# Altium schematic sheet motherboard.SchDoc
size A3
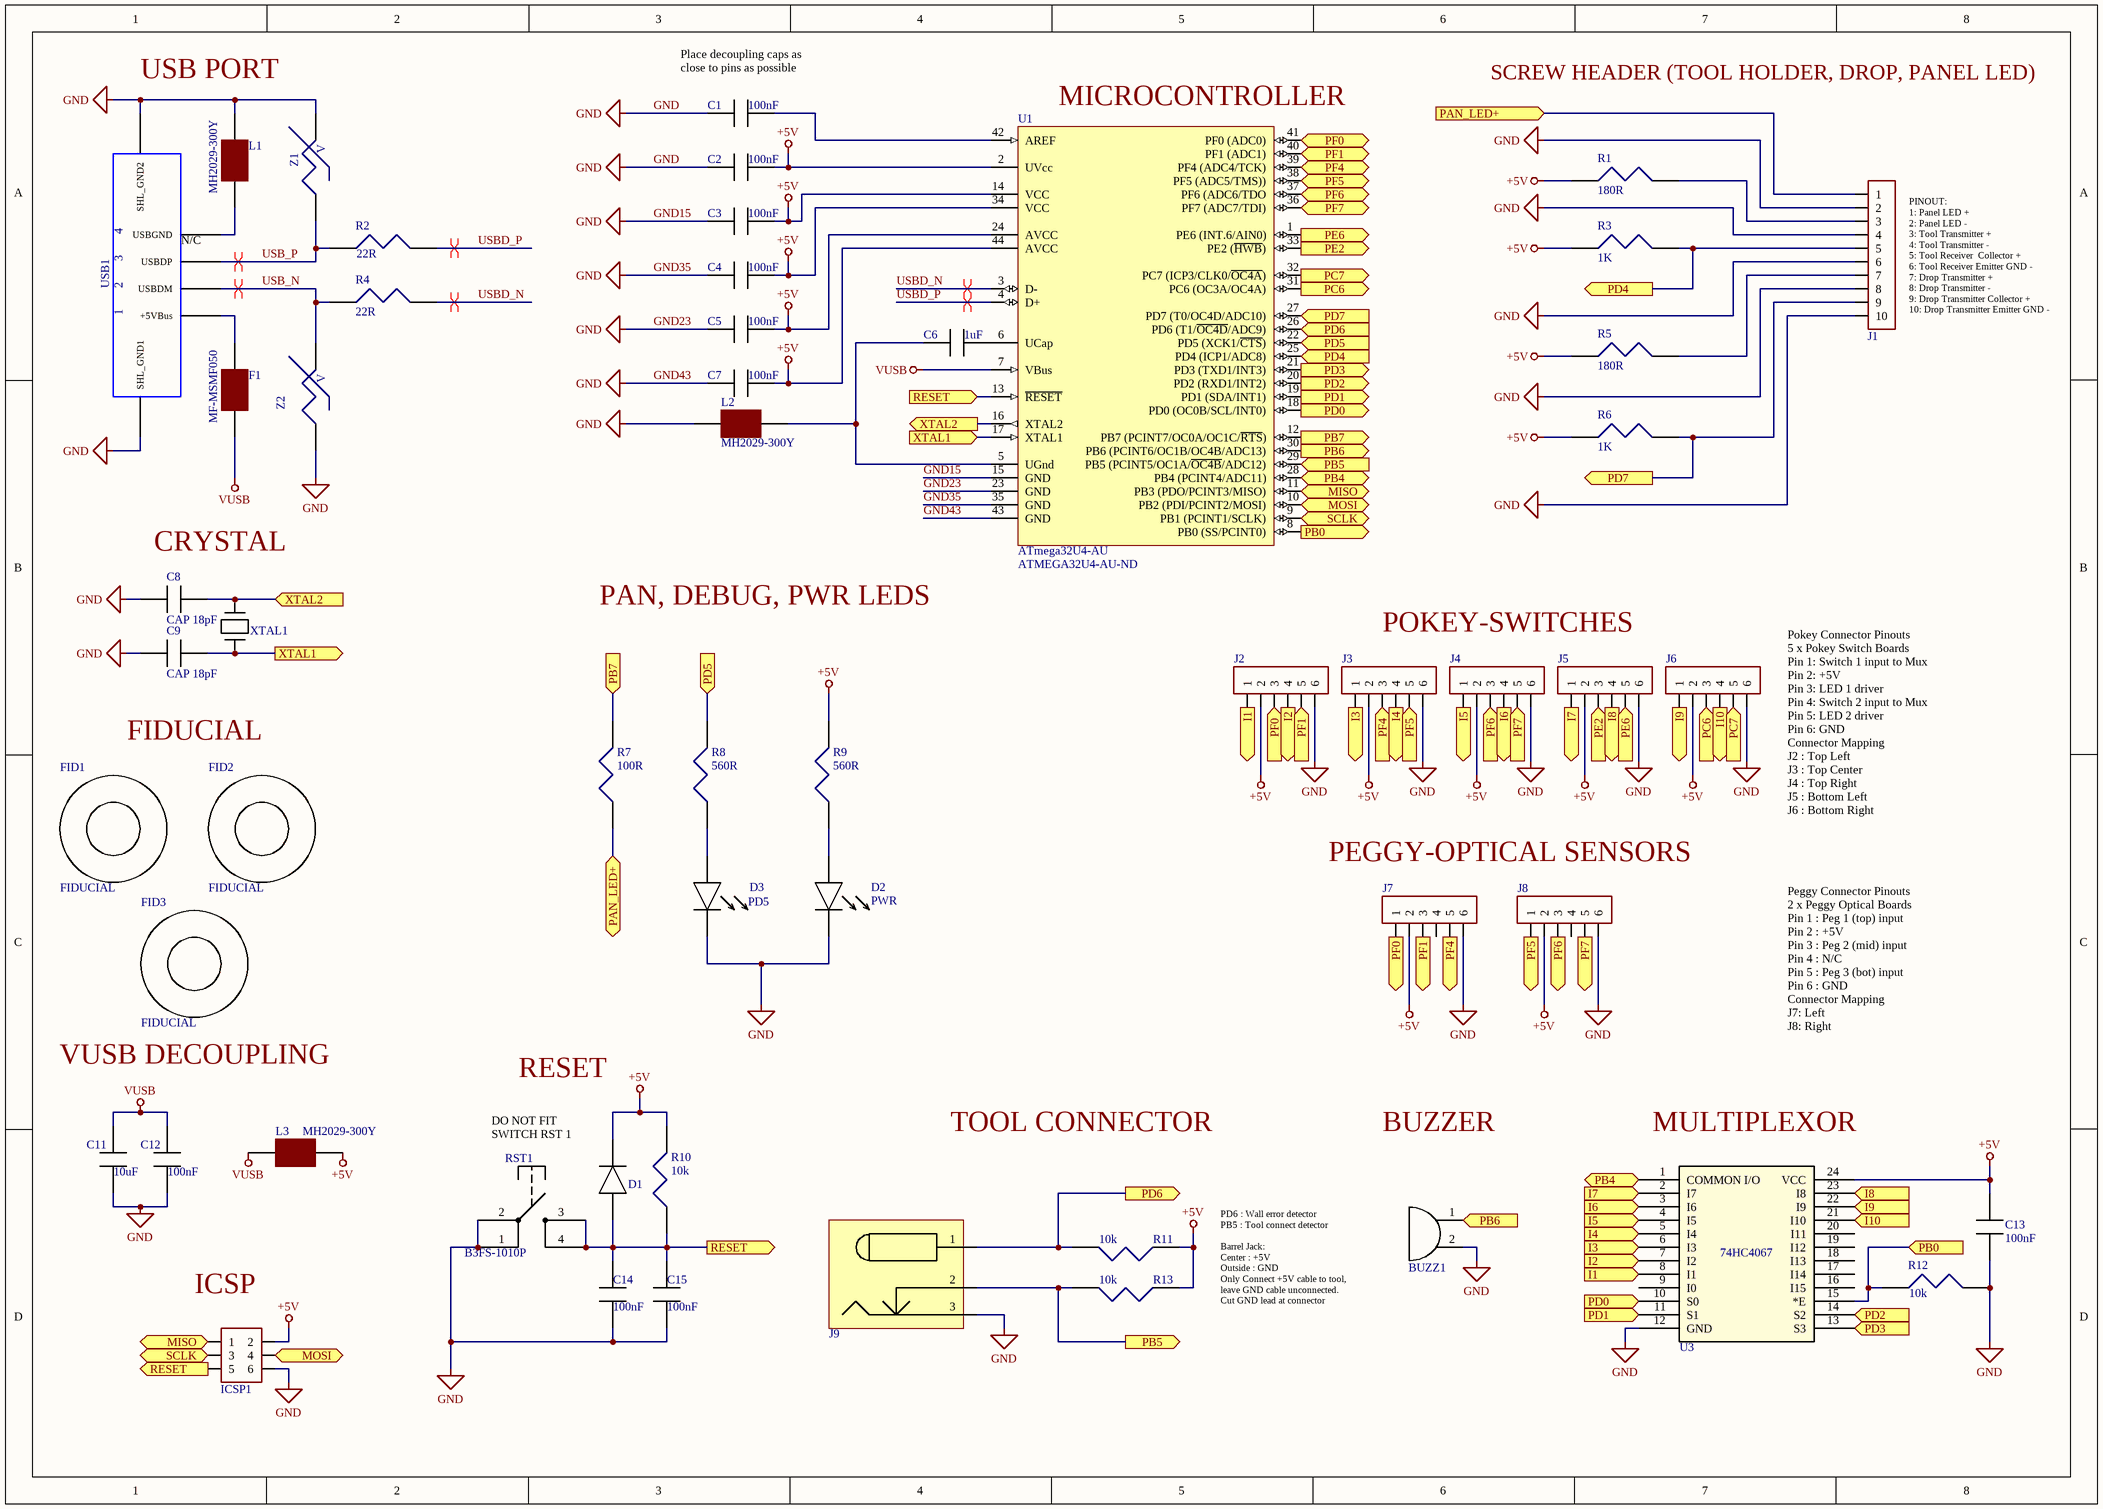
[diagram p0: motherboard.SchDoc]

## Parts
BUZZ1  CMT-1203-SMT-TR  [BUZZER]  (value not drawn)
C1  100nF  [CAPC2012X09N]
C2  100nF  [CAPC2012X09N]
C3  100nF  [CAPC2012X09N]
C4  100nF  [CAPC2012X09N]
C5  100nF  [CAPC2012X09N]
C6  1uF  [CAPC2012X14N]
C7  100nF  [CAPC2012X09N]
C8  CAP 18pF  [CAPC2012X08N]
C9  CAP 18pF  [CAPC2012X08N]
C11  10uF  [CAPC2012X14N]
C12  100nF  [CAPC2012X09N]
C13  100nF  [CAPC2012X09N]
C14  100nF  [CAPC2012X09N]
C15  100nF  [CAPC2012X09N]
D1  Diode 100V 150mA  [DIOC3215X09N]  (value not drawn)
D2  PWR  [0603LED]
D3  PD5  [0603LED]
F1  MF-MSMF050  [FUSE MF-MSMF050]
FID1  FIDUCIAL  [FID]  (no BOM)
FID2  FIDUCIAL  [FID]  (no BOM)
FID3  FIDUCIAL  [FID]  (no BOM)
ICSP1  67997-206HLF  [3x2 Pin Header]  (value not drawn)
J1  CONN 10 POS  [CONN 10 POS]  (value not drawn)
J2  POK-TL  [FFC CONNECTOR]  (value not drawn)
J3  POK-TM  [FFC CONNECTOR]  (value not drawn)
J4  POK-TR  [FFC CONNECTOR]  (value not drawn)
J5  POK-BL  [FFC CONNECTOR]  (value not drawn)
J6  POK-BR  [FFC CONNECTOR]  (value not drawn)
J7  PEG-L  [FFC CONNECTOR]  (value not drawn)
J8  PEG-R  [FFC CONNECTOR]  (value not drawn)
J9  Barrel Connector  [Barrel Power Connector]  (value not drawn)
L1  MH2029-300Y  [INDC2012X11N]
L2  MH2029-300Y  [INDC2012X11N]
L3  MH2029-300Y  [INDC2012X11N]
R1  180R  [RESC2012X07N_SAMSUNG]
R2  22R  [RESC2012X07N]
R3  1K  [RESC2012X07N_SAMSUNG]
R4  22R  [RESC2012X07N]
R5  180R  [RESC2012X07N_SAMSUNG]
R6  1K  [RESC2012X07N_SAMSUNG]
R7  100R  [RESC2012X07N_SAMSUNG]
R8  560R  [RESC2012X07N_SAMSUNG]
R9  560R  [RESC2012X07N_SAMSUNG]
R10  10k  [RESC2012X07N_SAMSUNG]
R11  10k  [RESC2012X07N_SAMSUNG]
R12  10k  [RESC2012X07N_SAMSUNG]
R13  10k  [RESC2012X07N_SAMSUNG]
RST1  B3FS-1010P  [SWITCH]
U1  ATmega32U4-AU  Supplier Part Number 1: ATMEGA32U4-AU-ND  [44ML_N]
U3  74HC4067 SOIC  [SOIC127P1030X265-24N]  (value not drawn)
USB1  USB  [USB B RECEPTACLE]  (value not drawn)
XTAL1  9C-16.000MEEJ-T  [XTAL]  (value not drawn)
Z1  CG0603MLC  [RESC1608X06N]  (value not drawn)
Z2  CG0603MLC  [RESC1608X06N]  (value not drawn)

## Ports
I1, I2, I3, I4, I5, I6, I7, I8, I9, I10, MISO, MOSI, PAN_LED+, PB0, PB4, PB5, PB6, PB7, PC6, PC7, PD0, PD1, PD2, PD3, PD4, PD5, PD6, PD7, PE2, PE6, PF0, PF1, PF4, PF5, PF6, PF7, RESET, SCLK, XTAL1, XTAL2

## Nets
+5V: C2.2 C3.1 C4.1 C5.1 C7.1 C13.2 D1.2 ICSP1.2 J2.2 J3.2 J4.2 J5.2 J6.2 J7.2 J8.2 L3.2 R1.1 R3.1 R5.1 R6.1 R9.2 R10.2 R11.1 R13.1 U1.2(UVcc) U1.14(VCC) U1.24(AVCC) U1.34(VCC) U1.44(AVCC) U3.24(VCC)
GND: BUZZ1.2 C1.1 C2.1 C3.2 C4.2 C5.2 C7.2 C8.1 C9.1 C11.1 C12.1 C13.1 C14.1 C15.1 D2.2 D3.2 ICSP1.6 J1.2 J1.4 J1.6 J1.8 J1.10 J2.6 J3.6 J4.6 J5.6 J6.6 J7.6 J8.6 J9.3 L1.2 L2.1 R12.2 RST1.1 RST1.2 U1.15(GND) U1.23(GND) U1.35(GND) U1.43(GND) U3.12(GND) USB1.SHL_GND1 USB1.SHL_GND2 Z1.2 Z2.1  [also labelled GND15, GND23, GND35, GND43]
VUSB: C11.2 C12.2 F1.1 L3.1 U1.7(VBus)
I1: J2.1 U3.8(I1) ; port I1
I2: J2.4 U3.7(I2) ; port I2
I3: J3.1 U3.6(I3) ; port I3
I4: J3.4 U3.5(I4) ; port I4
I5: J4.1 U3.4(I5) ; port I5
I6: J4.4 U3.3(I6) ; port I6
I7: J5.1 U3.2(I7) ; port I7
I8: J5.4 U3.23(I8) ; port I8
I9: J6.1 U3.22(I9) ; port I9
I10: J6.4 U3.21(I10) ; port I10
MISO: ICSP1.1 U1.11(PB3_(PDO/PCINT3/MISO)) ; port MISO
MOSI: ICSP1.4 U1.10(PB2_(PDI/PCINT2/MOSI)) ; port MOSI
PAN_LED+: J1.1 R7.1 ; port PAN_LED+
PB0: R12.1 U1.8(PB0_(SS/PCINT0)) U3.15(*E) ; port PB0
PB4: U1.28(PB4_(PCINT4/ADC11)) U3.1(COMMON_I/O) ; port PB4
PB5: J9.2 R13.2 U1.29(PB5_(PCINT5/OC1A/~{OC4B}/ADC12)) ; port PB5
PB6: BUZZ1.1 U1.30(PB6_(PCINT6/OC1B/OC4B/ADC13)) ; port PB6
PB7: R7.2 U1.12(PB7_(PCINT7/OC0A/OC1C/~{RTS})) ; port PB7
PC6: J6.3 U1.31(PC6_(OC3A/OC4A)) ; port PC6
PC7: J6.5 U1.32(PC7_(ICP3/CLK0/~{OC4A})) ; port PC7
PD0: U1.18(PD0_(OC0B/SCL/INT0)) U3.10(S0) ; port PD0
PD1: U1.19(PD1_(SDA/INT1)) U3.11(S1) ; port PD1
PD2: U1.20(PD2_(RXD1/INT2)) U3.14(S2) ; port PD2
PD3: U1.21(PD3_(TXD1/INT3)) U3.13(S3) ; port PD3
PD4: J1.5 R3.2 U1.25(PD4_(ICP1/ADC8)) ; port PD4
PD5: R8.2 U1.22(PD5_(XCK1/~{CTS})) ; port PD5
PD6: J9.1 R11.2 U1.26(PD6_(T1/~{OC4D}/ADC9)) ; port PD6
PD7: J1.9 R6.2 U1.27(PD7_(T0/OC4D/ADC10)) ; port PD7
PE2: J5.3 U1.33(PE2_(~{HWB})) ; port PE2
PE6: J5.5 U1.1(PE6_(INT.6/AIN0)) ; port PE6
PF0: J2.3 J7.1 U1.41(PF0_(ADC0)) ; port PF0
PF1: J2.5 J7.3 U1.40(PF1_(ADC1)) ; port PF1
PF4: J3.3 J7.5 U1.39(PF4_(ADC4/TCK)) ; port PF4
PF5: J3.5 J8.1 U1.38(PF5_(ADC5/TMS))) ; port PF5
PF6: J4.3 J8.3 U1.37(PF6_(ADC6/TDO) ; port PF6
PF7: J4.5 J8.5 U1.36(PF7_(ADC7/TDI)) ; port PF7
RESET: C14.2 C15.2 D1.1 ICSP1.5 R10.1 RST1.3 RST1.4 U1.13(~{RESET}) ; port RESET
SCLK: ICSP1.3 U1.9(PB1_(PCINT1/SCLK)) ; port SCLK
USB_N: R4.1 USB1.USBDM Z2.2
USB_P: R2.1 USB1.USBDP Z1.1
USBD_N: R4.2 U1.3(D-)
USBD_P: R2.2 U1.4(D+)
XTAL1: C9.2 U1.17(XTAL1) XTAL1.1 ; port XTAL1
XTAL2: C8.2 U1.16(XTAL2) XTAL1.2 ; port XTAL2
NetC1_2: C1.2 U1.42(AREF)
NetC6_1: C6.1 L2.2 U1.5(UGnd)
NetC6_2: C6.2 U1.6(UCap)
NetD2_1: D2.1 R9.1
NetD3_1: D3.1 R8.1
NetF1_2: F1.2 USB1.+5VBus
NetJ1_3: J1.3 R1.2
NetJ1_7: J1.7 R5.2
NetL1_1: L1.1 USB1.USBGND

Not connected (* = marked no-connect by the designer): J7 4; J8 4; U3 9(I0) 16(I15) 17(I14) 18(I13) 19(I12) 20(I11)

## Layout directives
differential pair: USB_N, USB_P, USBD_N, USBD_P

## Notes on the sheet
- USB PORT
- (near C1) Place decoupling caps as close to pins as possible
- (near U1) MICROCONTROLLER
- SCREW HEADER (TOOL HOLDER, DROP, PANEL LED)
- (near USB1) N/C
- (near J1) PINOUT:
  1: Panel LED +
  2: Panel LED -
  3: Tool Transmitter +
  4: Tool Transmitter -
  5: Tool Receiver  Collector +
  6: Tool Receiver Emitter GND -
  7: Drop Transmitter +
  8: Drop Transmitter -
  9: Drop Transmitter Collector +
  10: Drop Transmitter Emitter GND -
- CRYSTAL
- PAN, DEBUG, PWR LEDS
- POKEY-SWITCHES
- FIDUCIAL
- (near J6) Pokey Connector Pinouts
  5 x Pokey Switch Boards
  Pin 1: Switch 1 input to Mux
  Pin 2: +5V
  Pin 3: LED 1 driver
  Pin 4: Switch 2 input to Mux
  Pin 5: LED 2 driver
  Pin 6: GND
  Connector Mapping
  J2 : Top Left
  J3 : Top Center
  J4 : Top Right
  J5 : Bottom Left
  J6 : Bottom Right
- PEGGY-OPTICAL SENSORS
- Peggy Connector Pinouts
  2 x Peggy Optical Boards
  Pin 1 : Peg 1 (top) input
  Pin 2 : +5V
  Pin 3 : Peg 2 (mid) input
  Pin 4 : N/C
  Pin 5 : Peg 3 (bot) input
  Pin 6 : GND
  Connector Mapping
  J7: Left
  J8: Right
- VUSB DECOUPLING
- RESET
- (near D1) DO NOT FIT SWITCH RST 1
- TOOL CONNECTOR
- BUZZER
- (near U3) MULTIPLEXOR
- (near ICSP1) ICSP
- PD6 : Wall error detector
  PB5 : Tool connect detector
  Barrel Jack:
  Center : +5V
  Outside : GND
  Only Connect +5V cable to tool, leave GND cable unconnected.
  Cut GND lead at connector
- (in symbol 61729-1011BLF) 3; 2; 1
- (in symbol CD74HC4067M96) 74HC4067
- (in symbol CG0603MLC-05E) V

## Library data of the parts
BUZZ1 = CMT-1203-SMT-TR: BUZZER PIEZO 5V 12MM SMD; Manufacturer: CUI Inc.; Driver Circuitry: Transducer, Externally Driven; Input Type: Peak-Peak Signal; Voltage Range: 25V (Max); Frequency: 4kHz; Operating Mode: Single Tone; Sound Pressure Level: 81dB @ 5V, 10cm; Current - Supply: 5mA; Port Location: Side; Supplier 1: Digi-Key; Manufacturer Part Number: CMT-1203-SMT-TR; RoHS: RoHS Compliant; Category: Audio Products; Stock 1: 18150; Pricing 1: 1=2.76, 10=2.29, 100=1.6962, 500=1.35696 (USD); Packaging: Cut Tape (CT); Technology: Piezo; Voltage - Rated: 5V; Duration: -; Operating Temperature: -40°C ~ 120°C; Approvals: -; Ratings: -; Mounting Type: Surface Mount; Termination: Solder Pads; Size / Dimension: 12.0mm L x 12.0mm W x 3.3mm H; Height - Seated (Max): *; ComponentLink1URL: http://www.cui.com/product/resource/digikeypdf/cmt-1203-smt.pdf; ComponentLink1Description: http://www.cui.com/product/resource/digikeypdf/cmt-1203-smt.pdf; Supplier Part Number 1: 102-2197-1-ND
C1-C5 C7 C12-C15 = CL21F104ZBCNNNC: CAP CER 0.1UF 50V Y5V 0805; Manufacturer: Samsung Electro-Mechanics America, Inc.; Capacitance: 0.10µF; Tolerance: -20%, +80%; Temperature Coefficient: Y5V (F); Supplier 1: Digi-Key; Manufacturer Part Number: CL21F104ZBCNNNC; RoHS: RoHS Compliant; Category: Capacitors; Stock 1: 1030146; Pricing 1: 1=0.1, 10=0.031, 25=0.022, 50=0.017, 100=0.0144, 500=0.01004, 1000=0.00783 (USD); Packaging: Cut Tape (CT); Voltage - Rated: 50V; Mounting Type: Surface Mount, MLCC; Operating Temperature: -30°C ~ 85°C; Applications: General Purpose; Ratings: -; Package / Case: 0805 (2012 Metric); Size / Dimension: 0.079" L x 0.049" W (2.00mm x 1.25mm); Height - Seated (Max): -; Thickness (Max): 0.037" (0.95mm); Lead Spacing: -; Features: -; Lead Style: -; ComponentLink1URL: http://www.samsungsem.com/kr/support/product-search/mlcc/CL21F104ZBCNNNC.jsp; ComponentLink1Description: http://www.samsungsem.com/kr/support/product-search/mlcc/CL21F104ZBCNNNC.jsp; Supplier Part Number 1: 1276-1007-1-ND
C6 = CL21A105KBCLNNC: CAP CER 1UF 50V X5R 0805; Manufacturer: Samsung Electro-Mechanics America, Inc.; Capacitance: 1µF; Tolerance: ±10%; Supplier 1: Digi-Key; Manufacturer Part Number: CL21A105KBCLNNC; RoHS: RoHS Compliant; Category: Capacitors; Stock 1: 6541; Pricing 1: 1=0.26, 10=0.216, 25=0.1484, 50=0.1216, 100=0.108, 500=0.07156, 1000=0.06345 (USD); Packaging: Cut Tape (CT); Voltage - Rated: 50V; Temperature Coefficient: X5R; Mounting Type: Surface Mount, MLCC; Operating Temperature: -55°C ~ 85°C; Applications: General Purpose; Ratings: -; Package / Case: 0805 (2012 Metric); Size / Dimension: 0.079" L x 0.049" W (2.00mm x 1.25mm); Height - Seated (Max): -; Thickness (Max): 0.037" (0.95mm); Lead Spacing: -; Features: -; Lead Style: -; ComponentLink1URL: http://media.digikey.com/pdf/Data%20Sheets/Samsung%20PDFs/CL21A105KBCLNNC_Spec.pdf; ComponentLink1Description: http://media.digikey.com/pdf/Data%20Sheets/Samsung%20PDFs/CL21A105KBCLNNC_Spec.pdf; Supplier Part Number 1: 1276-2396-1-ND
C8 C9 = CL21C180JBANNNC: CAP CER 18PF 50V NP0 0805; Manufacturer: Samsung Electro-Mechanics America, Inc.; Tolerance: ±5%; Temperature Coefficient: C0G, NP0; Supplier 1: Digi-Key; Manufacturer Part Number: CL21C180JBANNNC; RoHS: RoHS Compliant; Category: Capacitors; Stock 1: 75846; Pricing 1: 1=0.1, 10=0.048, 25=0.034, 50=0.026, 100=0.022, 500=0.0154, 1000=0.012 (USD); Packaging: Cut Tape (CT); Capacitance: 18pF; Voltage - Rated: 50V; Mounting Type: Surface Mount, MLCC; Operating Temperature: -55°C ~ 125°C; Applications: General Purpose; Ratings: -; Package / Case: 0805 (2012 Metric); Size / Dimension: 0.079" L x 0.049" W (2.00mm x 1.25mm); Height - Seated (Max): -; Thickness (Max): 0.030" (0.75mm); Lead Spacing: -; Features: -; Lead Style: -; ComponentLink1URL: http://www.samsungsem.com/kr/support/product-search/mlcc/CL21C180JBANNNC.jsp; ComponentLink1Description: http://www.samsungsem.com/kr/support/product-search/mlcc/CL21C180JBANNNC.jsp; Supplier Part Number 1: 1276-1107-1-ND
C11 = CL21A106KAYNNNE: CAP CER 10UF 25V X5R 0805; Manufacturer: Samsung Electro-Mechanics America, Inc.; Capacitance: 10µF; Tolerance: ±10%; Supplier 1: Digi-Key; Manufacturer Part Number: CL21A106KAYNNNE; RoHS: RoHS Compliant; Category: Capacitors; Stock 1: 312876; Pricing 1: 1=0.24, 10=0.165, 25=0.12, 50=0.1, 100=0.084, 500=0.06, 1000=0.051 (USD); Packaging: Cut Tape (CT); Voltage - Rated: 25V; Temperature Coefficient: X5R; Mounting Type: Surface Mount, MLCC; Operating Temperature: -55°C ~ 85°C; Applications: General Purpose; Ratings: -; Package / Case: 0805 (2012 Metric); Size / Dimension: 0.079" L x 0.049" W (2.00mm x 1.25mm); Height - Seated (Max): -; Thickness (Max): 0.057" (1.45mm); Lead Spacing: -; Features: -; Lead Style: -; ComponentLink1URL: http://www.samsungsem.com/kr/support/product-search/mlcc/CL21A106KAYNNNE.jsp; ComponentLink1Description: http://www.samsungsem.com/kr/support/product-search/mlcc/CL21A106KAYNNNE.jsp; Supplier Part Number 1: 1276-2891-1-ND
D1 = CD1206-S01575: DIODE GEN PURP 100V 150MA 1206; Manufacturer: Bourns Inc.; Diode Type: Standard; Voltage - Forward (Vf) (Max) @ If: 1V @ 50mA; Speed: Small Signal =< 200mA (Io), Any Speed; Reverse Recovery Time (trr): 4ns; Current - Reverse Leakage @ Vr: 2.5µA @ 100V; Capacitance @ Vr, F: 3pF @ 0V, 100MHz; Supplier 1: Digi-Key; Manufacturer Part Number: CD1206-S01575; RoHS: RoHS Compliant; Category: Discrete Semiconductor Products; Stock 1: 15991; Pricing 1: 1=0.15, 10=0.142, 25=0.1288, 100=0.0927, 250=0.0546, 500=0.0453, 1000=0.0309, 2500=0.0263 (USD); Packaging: Cut Tape (CT); Voltage - DC Reverse (Vr) (Max): 100V; Current - Average Rectified (Io): 150mA; Mounting Type: Surface Mount; Package / Case: 1206 (3216 Metric); Supplier Device Package: 1206; Operating Temperature - Junction: -55°C ~ 125°C; ComponentLink1URL: http://www.bourns.com/docs/Product-Datasheets/CD1206_S01575.pdf; ComponentLink1Description: http://www.bourns.com/docs/Product-Datasheets/CD1206_S01575.pdf; Supplier Part Number 1: CD1206-S01575CT-ND
D2 = LG L29K-F2J1-24: LED GREEN DIFFUSED 0603 SMD; Manufacturer: OSRAM Opto Semiconductors Inc.; Lens Color: White; Millicandela Rating: 3.5mcd; Lens Style/Size: Rectangle with Flat Top, 1.30mm x 0.80mm; Voltage - Forward (Vf) (Typ): 1.7V; Current - Test: 2mA; Viewing Angle: 160°; Wavelength - Dominant: 570nm; Wavelength - Peak: 572nm; Supplier 1: Digi-Key; Manufacturer Part Number: LG L29K-F2J1-24; RoHS: RoHS Compliant; Category: Optoelectronics; Stock 1: 30762; Pricing 1: 1=0.38, 10=0.266, 25=0.2184, 100=0.1746, 250=0.13092, 500=0.11902, 1000=0.09522, 2500=0.07737 (USD); Packaging: Cut Tape (CT); Color: Green; Lens Transparency: Diffused; Mounting Type: Surface Mount; Features: -; Package / Case: 0603 (1608 Metric); Supplier Device Package: *; Size / Dimension: 1.70mm L x 0.80mm W; Height (Max): 0.65mm; ComponentLink1URL: http://www.osram-os.com/Graphics/XPic2/00077107_0.pdf; ComponentLink1Description: http://www.osram-os.com/Graphics/XPic2/00077107_0.pdf; Supplier Part Number 1: 475-1193-1-ND
D3 = LS L29K-H1J2-1-Z: LED RED DIFFUSED 0603 SMD; Manufacturer: OSRAM Opto Semiconductors Inc.; Lens Color: White; Millicandela Rating: 4.95mcd; Lens Style/Size: Rectangle with Flat Top, 1.30mm x 0.80mm; Voltage - Forward (Vf) (Typ): 1.8V; Current - Test: 2mA; Viewing Angle: 160°; Wavelength - Dominant: 630nm; Wavelength - Peak: 643nm; Supplier 1: Digi-Key; Manufacturer Part Number: LS L29K-H1J2-1-Z; RoHS: RoHS Compliant; Category: Optoelectronics; Stock 1: 77723; Pricing 1: 1=0.33, 10=0.257, 25=0.2096, 100=0.1666, 250=0.14284, 500=0.12378, 1000=0.09522, 2500=0.0857 (USD); Packaging: Cut Tape (CT); Color: Red; Lens Transparency: Diffused; Mounting Type: Surface Mount; Features: -; Package / Case: 0603 (1608 Metric); Supplier Device Package: *; Size / Dimension: 1.70mm L x 0.80mm W; Height (Max): 0.65mm; ComponentLink1URL: http://www.osram-os.com/Graphics/XPic2/00077099_0.pdf; ComponentLink1Description: http://www.osram-os.com/Graphics/XPic2/00077099_0.pdf; Supplier Part Number 1: 475-1195-1-ND
F1 = MF-MSMF050-2: PTC RESETTABLE .50A 15V 1812; Manufacturer: Bourns Inc.; Current - Max: 100A; Current - Hold (Ih) (Max): 500mA; Current - Trip (It): 1A; R Min/Max: 0.150 ~ 1.000 Ohm; Time to Trip: 0.15s; Supplier 1: Digi-Key; Manufacturer Part Number: MF-MSMF050-2; RoHS: RoHS Compliant; Category: Circuit Protection; Stock 1: 97387; Pricing 1: 1=0.22, 10=0.201, 25=0.186, 50=0.1794, 100=0.167, 250=0.14868, 500=0.1239, 1000=0.11741 (USD); Packaging: Cut Tape (CT); Voltage - Max: 15V; Package / Case: 1812 (4532 Metric), Concave; ComponentLink1URL: http://www.bourns.com/docs/Product-Datasheets/mfmsmf.pdf; ComponentLink1Description: http://www.bourns.com/docs/Product-Datasheets/mfmsmf.pdf; Supplier Part Number 1: MF-MSMF050-2CT-ND
FID1-FID3 = Fiducial 1
ICSP1 = 67997-206HLF: CONN HEADER 6POS .100 STR 15AU; Manufacturer: Amphenol FCI; Connector Type: Header, Unshrouded; Number of Positions: 6; Number of Positions Loaded: All; Pitch: 0.100" (2.54mm); Supplier 1: Digi-Key; Manufacturer Part Number: 67997-206HLF; RoHS: RoHS Compliant; Category: Connectors, Interconnects; Stock 1: 15596; Pricing 1: 1=0.31, 10=0.292, 25=0.2504, 100=0.2046, 250=0.18372, 500=0.17536, 1000=0.14613, 2500=0.1336, 5000=0.12525 (USD); Packaging: Bulk; Contact Type: Male Pin; Number of Rows: 2; Row Spacing: 0.100" (2.54mm); Contact Mating Length: 0.230" (5.84mm); Mounting Type: Through Hole; Termination: Solder; Fastening Type: -; Features: -; Contact Finish: Gold or Gold, GXT™; Contact Finish Thickness: 15µin (0.38µm); Color: Black; ComponentLink1URL: http://portal.fciconnect.com/Comergent//fci/drawing/67996.pdf; ComponentLink1Description: http://portal.fciconnect.com/Comergent//fci/drawing/67996.pdf; Supplier Part Number 1: 609-3234-ND
J1 = 1-282834-0: TERM BLOCK 10POS SIDE ENT 2.54MM; Manufacturer: TE Connectivity AMP Connectors; Number of Levels: 1; Positions Per Level: 10; Pitch: 0.100" (2.54mm); Mating Orientation: Horizontal with Board; Current: 10A; Voltage: 150V; Wire Gauge: 16-30 AWG; Wire Termination: Screw - Rising Cage Clamp; Clamp Material - Plating: Brass - Nickel Plated; Screw Material - Plating: Steel, Stainless; Torque - Screw: 0.2 Nm (1.7 Lb-In); Screw Thread: M1.6; Supplier 1: Digi-Key; Manufacturer Part Number: 1-282834-0; RoHS: RoHS Compliant; Category: Connectors, Interconnects; Stock 1: 4437; Pricing 1: 1=6.12, 10=4.662, 25=4.3668, 50=3.8816, 100=3.7972, 250=3.50184, 500=3.16432, 1000=2.80569, 2500=2.68966 (USD); Packaging: Bulk; Mounting Type: Through Hole; Features: -; Color: Green; Operating Temperature: -40°C ~ 105°C; Housing Material: Polyamide (PA66), Nylon 6/6; Contact Material - Plating: Brass - Tin Plated; ComponentLink1URL: http://www.te.com/commerce/DocumentDelivery/DDEController?Action=srchrtrv&DocNm=282834&DocType=Customer+Drawing&DocLang=English; ComponentLink1Description: http://www.te.com/commerce/DocumentDelivery/DDEController?Action=srchrtrv&DocNm=282834&DocType=Customer+Drawing&DocLang=English; Supplier Part Number 1: A98074-ND
J2-J8 = 0525590652: CONN FFC VERT 6POS 0.50MM SMD; Manufacturer: Molex, LLC; Flat Flex Type: FFC, FPC; Connector/Contact Type: Contacts, Vertical, 1 Sided; Number of Positions: 6; Pitch: 0.020" (0.50mm); FFC, FCB Thickness: 0.30mm; Locking Feature: Slide Lock; Cable End Type: Straight, Tapered; Actuator Material: Polyphenylene Sulfide (PPS); Voltage Rating: 50V; Material Flammability Rating: UL94 V-0; Current Rating: 0.5A; Supplier 1: Digi-Key; Manufacturer Part Number: 0525590652; RoHS: RoHS Compliant; Category: Connectors, Interconnects; Stock 1: 12166; Pricing 1: 1=1.56, 10=1.375, 25=1.294, 50=1.2402, 100=1.1863, 250=1.07844, 500=0.9706 (USD); Packaging: Cut Tape (CT); Mounting Type: Surface Mount; Termination: Solder; Height Above Board: 0.154" (3.90mm); Contact Material: Phosphor Bronze; Contact Finish: Gold; Housing Material: Polyamide (PA46), Nylon 4/6; Features: Zero Insertion Force (ZIF); Operating Temperature: -40°C ~ 85°C; ComponentLink1URL: http://www.molex.com/pdm_docs/sd/525590652_sd.pdf; ComponentLink1Description: http://www.molex.com/pdm_docs/sd/525590652_sd.pdf; Supplier Part Number 1: WM7982CT-ND
J9 = PJ-002AH-SMT-TR: CONN POWER JACK 2.1X5.5MM HI CUR; Manufacturer: CUI Inc.; Gender: Male; Plug/Mating Plug Diameter: 2.1mm ID, 5.5mm OD; Number of Positions/Contacts: 2 Conductors, 3 Contacts; Internal Switch(s): Single Switch, Normally Closed; Shielding: Unshielded; Voltage - Rated: 24VDC; Current Rating: 5A; Supplier 1: Digi-Key; Manufacturer Part Number: PJ-002AH-SMT-TR; RoHS: RoHS Compliant; Category: Connectors, Interconnects; Stock 1: 140776; Pricing 1: 1=1.89, 10=1.469, 100=1.121 (USD); Connector Type: Jack; Mounting Type: Surface Mount; Termination: Solder; Features: -; Color: Black; Contact Material: Copper Alloy; Contact Material - Plating: Nickel; Housing Color: Black; Housing Material: Thermoplastic; Operating Temperature: -25°C ~ 85°C; ComponentLink1URL: http://www.cui.com/product/resource/digikeypdf/pj-002ah-smt.pdf; ComponentLink1Description: http://www.cui.com/product/resource/digikeypdf/pj-002ah-smt.pdf; Supplier Part Number 1: CP-002AHPJCT-ND
L1-L3 = MH2029-300Y: EMI Filter Beads, Chips & Arrays Impedance 30ohms IDC 3.0; Manufacturer: Bourns; Maximum DC Current: 3 A; Maximum DC Resistance: 25 mOhms; Tolerance: 25 %; Type: High Current Chip Ferrite Bead; Test Frequency: 100 MHz; Filter Type: Power, Signal Line; Number of Lines: 1; Impedance @ Frequency: 30 Ohm @ 100MHz; Current Rating (Max): 3A; DC Resistance (DCR) (Max): 25 mOhm; Supplier 1: Digi-Key; Manufacturer Part Number: MH2029-300Y; RoHS: RoHS Compliant; Category: EMI Filter Beads, Chips & Arrays; Stock 1: 62738; Pricing 1: 1=0.1, 10=0.062, 25=0.0568, 50=0.051, 100=0.0375, 250=0.02724, 500=0.02498, 1000=0.02157 (USD); Capacitance: -; Height: 0.9 mm; Impedance: 30 Ohms; Length: 2 mm; Operating Temperature Range: - 55 C to + 125 C; Package / Case: 0805 (2012 metric); Packaging: Reel; Product: Ferrite Chip Beads; Termination Style: SMD/SMT; Width: 1.2 mm; Brand: Bourns; Product Category: SMD Ferrite Bead; Standard Pack Qty: 4000; RoHS - Mouser: Y; Minimum Order Quantity: 1; Reeling: True; ComponentLink1URL: http://www.mouser.com/ds/2/54/h-777565.pdf; ComponentLink1Description: http://www.mouser.com/ds/2/54/h-777565.pdf; Supplier Part Number 1: MH2029-300YCT-ND; Ratings: -; Operating Temperature: -55°C ~ 125°C; Mounting Type: Surface Mount; Height (Max): 0.043" (1.10mm); Size / Dimension: 0.079" L x 0.047" W (2.00mm x 1.20mm); ComponentLink2URL: http://www.bourns.com/docs/Product-Datasheets/mh.pdf; ComponentLink2Description: http://www.bourns.com/docs/Product-Datasheets/mh.pdf
R1 R5 = RC2012F181CS: RES SMD 180 OHM 1% 1/8W 0805; Manufacturer: Samsung Electro-Mechanics America, Inc.; Resistance (Ohms): 180; Power (Watts): 0.125W, 1/8W; Temperature Coefficient: ±100ppm/°C; Supplier 1: Digi-Key; Manufacturer Part Number: RC2012F181CS; RoHS: RoHS Compliant; Category: Resistors; Stock 1: 7245; Pricing 1: 1=0.1, 10=0.022, 25=0.016, 50=0.0124, 100=0.0091, 500=0.00554, 1000=0.00408 (USD); Packaging: Cut Tape (CT); Tolerance: ±1%; Composition: Thick Film; Features: Moisture Resistant; Operating Temperature: -55°C ~ 155°C; Package / Case: 0805 (2012 Metric); Supplier Device Package: 0805 (2012 Metric); Size / Dimension: 0.079" L x 0.049" W (2.00mm x 1.25mm); Height: 0.024" (0.60mm); Number of Terminations: 2; ComponentLink1URL: http://media.digikey.com/pdf/Data%20Sheets/Samsung%20PDFs/RC_Series_ds.pdf; ComponentLink1Description: http://media.digikey.com/pdf/Data%20Sheets/Samsung%20PDFs/RC_Series_ds.pdf; Supplier Part Number 1: 1276-5232-1-ND
R2 R4 = ERJ-6ENF22R0V: RES SMD 22 OHM 1% 1/8W 0805; Manufacturer: Panasonic Electronic Components; Resistance (Ohms): 22; Power (Watts): 0.125W, 1/8W; Temperature Coefficient: ±100ppm/°C; Supplier 1: Digi-Key; Manufacturer Part Number: ERJ-6ENF22R0V; RoHS: RoHS Compliant; Category: Resistors; Stock 1: 168629; Pricing 1: 1=0.1, 50=0.022, 100=0.0162, 250=0.01236, 500=0.0099, 1000=0.00729 (USD); Packaging: Cut Tape (CT); Tolerance: ±1%; Composition: Thick Film; Features: Automotive AEC-Q200; Operating Temperature: -55°C ~ 155°C; Package / Case: 0805 (2012 Metric); Supplier Device Package: 0805; Size / Dimension: 0.079" L x 0.049" W (2.00mm x 1.25mm); Height: 0.028" (0.70mm); Number of Terminations: 2; ComponentLink1URL: http://industrial.panasonic.com/www-cgi/jvcr13pz.cgi?E+PZ+3+AOA0002+ERJ6ENF22R0V+7+WW; ComponentLink1Description: http://industrial.panasonic.com/www-cgi/jvcr13pz.cgi?E+PZ+3+AOA0002+ERJ6ENF22R0V+7+WW; Supplier Part Number 1: P22.0CCT-ND
R3 R6 = RC2012F102CS: RES SMD 1K OHM 1% 1/8W 0805; Manufacturer: Samsung Electro-Mechanics America, Inc.; Power (Watts): 0.125W, 1/8W; Temperature Coefficient: ±100ppm/°C; Supplier 1: Digi-Key; Manufacturer Part Number: RC2012F102CS; RoHS: RoHS Compliant; Category: Resistors; Stock 1: 8929; Pricing 1: 1=0.1, 10=0.022, 25=0.016, 50=0.0124, 100=0.0091, 500=0.00554, 1000=0.00408 (USD); Packaging: Cut Tape (CT); Resistance (Ohms): 1k; Tolerance: ±1%; Composition: Thick Film; Features: Moisture Resistant; Operating Temperature: -55°C ~ 155°C; Package / Case: 0805 (2012 Metric); Supplier Device Package: 0805 (2012 Metric); Size / Dimension: 0.079" L x 0.049" W (2.00mm x 1.25mm); Height: 0.024" (0.60mm); Number of Terminations: 2; ComponentLink1URL: http://media.digikey.com/pdf/Data%20Sheets/Samsung%20PDFs/RC_Series_ds.pdf; ComponentLink1Description: http://media.digikey.com/pdf/Data%20Sheets/Samsung%20PDFs/RC_Series_ds.pdf; Supplier Part Number 1: 1276-5272-1-ND
R7 = RC2012F101CS: RES SMD 100 OHM 1% 1/8W 0805; Manufacturer: Samsung Electro-Mechanics America, Inc.; Resistance (Ohms): 100; Power (Watts): 0.125W, 1/8W; Temperature Coefficient: ±100ppm/°C; Supplier 1: Digi-Key; Manufacturer Part Number: RC2012F101CS; RoHS: RoHS Compliant; Category: Resistors; Stock 1: 60548; Pricing 1: 1=0.1, 10=0.022, 25=0.016, 50=0.0124, 100=0.0091, 500=0.00554, 1000=0.00408 (USD); Packaging: Cut Tape (CT); Tolerance: ±1%; Composition: Thick Film; Features: Moisture Resistant; Operating Temperature: -55°C ~ 155°C; Package / Case: 0805 (2012 Metric); Supplier Device Package: 0805 (2012 Metric); Size / Dimension: 0.079" L x 0.049" W (2.00mm x 1.25mm); Height: 0.024" (0.60mm); Number of Terminations: 2; ComponentLink1URL: http://media.digikey.com/pdf/Data%20Sheets/Samsung%20PDFs/RC_Series_ds.pdf; ComponentLink1Description: http://media.digikey.com/pdf/Data%20Sheets/Samsung%20PDFs/RC_Series_ds.pdf; Supplier Part Number 1: 1276-5224-1-ND
R8 R9 = RC2012F561CS: RES SMD 560 OHM 1% 1/8W 0805; Manufacturer: Samsung Electro-Mechanics America, Inc.; Resistance (Ohms): 560; Power (Watts): 0.125W, 1/8W; Temperature Coefficient: ±100ppm/°C; Supplier 1: Digi-Key; Manufacturer Part Number: RC2012F561CS; RoHS: RoHS Compliant; Category: Resistors; Stock 1: 12893; Pricing 1: 1=0.1, 10=0.022, 25=0.016, 50=0.0124, 100=0.0091, 500=0.00554, 1000=0.00408 (USD); Packaging: Cut Tape (CT); Tolerance: ±1%; Composition: Thick Film; Features: Moisture Resistant; Operating Temperature: -55°C ~ 155°C; Package / Case: 0805 (2012 Metric); Supplier Device Package: 0805 (2012 Metric); Size / Dimension: 0.079" L x 0.049" W (2.00mm x 1.25mm); Height: 0.024" (0.60mm); Number of Terminations: 2; ComponentLink1URL: http://media.digikey.com/pdf/Data%20Sheets/Samsung%20PDFs/RC_Series_ds.pdf; ComponentLink1Description: http://media.digikey.com/pdf/Data%20Sheets/Samsung%20PDFs/RC_Series_ds.pdf; Supplier Part Number 1: 1276-5257-1-ND
R10-R13 = RC2012F103CS: RES SMD 10K OHM 1% 1/8W 0805; Manufacturer: Samsung Electro-Mechanics America, Inc.; Power (Watts): 0.125W, 1/8W; Temperature Coefficient: ±100ppm/°C; Supplier 1: Digi-Key; Manufacturer Part Number: RC2012F103CS; RoHS: RoHS Compliant; Category: Resistors; Stock 1: 234992; Pricing 1: 1=0.1, 10=0.022, 25=0.016, 50=0.0124, 100=0.0091, 500=0.00554, 1000=0.00408 (USD); Packaging: Cut Tape (CT); Resistance (Ohms): 10k; Tolerance: ±1%; Composition: Thick Film; Features: Moisture Resistant; Operating Temperature: -55°C ~ 155°C; Package / Case: 0805 (2012 Metric); Supplier Device Package: 0805 (2012 Metric); Size / Dimension: 0.079" L x 0.049" W (2.00mm x 1.25mm); Height: 0.024" (0.60mm); Number of Terminations: 2; ComponentLink1URL: http://media.digikey.com/pdf/Data%20Sheets/Samsung%20PDFs/RC_Series_ds.pdf; ComponentLink1Description: http://media.digikey.com/pdf/Data%20Sheets/Samsung%20PDFs/RC_Series_ds.pdf; Supplier Part Number 1: 1276-5332-1-ND
RST1 = B3FS-1010P: SWITCH TACTILE SPST-NO 0.05A 24V; Manufacturer: Omron Electronics Inc-EMC Div; Switch Function: Off-Mom; Contact Rating @ Voltage: 0.05A @ 24VDC; Actuator Type: Standard; Actuator Height off PCB, from Pins: 4.30mm; Actuator Orientation: Top Actuated; Outline: 6.30mm x 6.00mm; Illumination: Non-Illuminated; Operating Force: 100gf; Switch Travel: 0.25mm; Mechanical Life: 1,000,000 Cycles; Supplier 1: Digi-Key; Manufacturer Part Number: B3FS-1010P; RoHS: RoHS Compliant; Category: Switches; Stock 1: 30103; Pricing 1: 1=0.79, 10=0.76, 25=0.7168, 50=0.6308, 100=0.5735, 250=0.54488, 500=0.53052 (USD); Packaging: Cut Tape (CT); Circuit: SPST-NO; Mounting Type: Surface Mount; Termination Style: Gull Wing; Illumination Voltage (Nominal): -; Illumination Type, Color: -; Ingress Protection: -; Features: -; Actuator Material: -; Operating Temperature: -25°C ~ 70°C; ComponentLink1URL: http://www.omron.com/ecb/products/pdf/en-b3fs.pdf; ComponentLink1Description: http://www.omron.com/ecb/products/pdf/en-b3fs.pdf; Supplier Part Number 1: SW1440CT-ND
U1 = CMP-0095-00285-2: 8-bit AVR Microcontroller, 2.7-5.5V, 16MHz, 32KB Flash, 1KB EEPROM, 2.5KB SRAM, USB Controller, 44-pin TQFP, Industrial Grade (-40°C to 85°C), Ext Osc; Manufacturer: Atmel; Connectivity: I²C, SPI, UART/USART, USB; Peripherals: Brown-out Detect/Reset, POR, PWM, WDT; Number of I/O: 26; Program Memory Size: 32KB (16K x 16); EEPROM Size: 1K x 8; RAM Size: 2.5K x 8; Voltage - Supply (Vcc/Vdd): 2.7 V ~ 5.5 V; Data Converters: A/D 12x10b; Oscillator Type: Internal; RevisionNote: DatasheetVersion updated. URLs added.; ComponentLink1Description: Manufacturer URL; PackageDescription: 44-Pin Plastic Thin Quad Flat Pack, 10 x 10 x 1.0 mm Body, 0.8 mm Pitch (TQFP); DatasheetVersion: revF, Nov-2010; ComponentLink2URL: http://www.atmel.com/dyn/resources/prod_documents/doc7766.pdf; ComponentLink1URL: http://www.atmel.com/; PackageReference: 44ML; ComponentLink2Description: ATmega16U4/32U4 Datasheet; PackageVersion: rev.G, Jul-2007; ComponentLink3URL: http://www.atmel.com/dyn/resources/prod_documents/7766S.pdf; ComponentLink3Description: ATmega16U4 ATmega32U4 Summary; Supplier 1: Digi-Key; Manufacturer Part Number: ATMEGA32U4-AU; RoHS: RoHS Compliant; Category: Integrated Circuits (ICs); Stock 1: 3024; Pricing 1: 1=6.32, 10=5.684, 25=5.1788, 100=4.6737, 250=4.29472, 500=3.91576, 1000=3.50875 (USD); Packaging: Tray; Core Processor: AVR; Core Size: 8-Bit; Speed: 16MHz; Program Memory Type: FLASH; Operating Temperature: -40°C ~ 85°C (TA); Package / Case: 44-TQFP; Supplier Device Package: 44-TQFP (10x10); ComponentLink4URL: http://media.digikey.com/pdf/Data%20Sheets/Atmel%20PDFs/ATmega16U4,32U4.pdf; ComponentLink4Description: http://media.digikey.com/pdf/Data%20Sheets/Atmel%20PDFs/ATmega16U4,32U4.pdf
U3 = CD74HC4067M96: IC MUX/DEMUX 1X16 24SOIC; Manufacturer: Texas Instruments; Multiplexer/Demultiplexer Circuit: 16:1; Number of Circuits: 1; On-State Resistance (Max): 160 Ohm; Channel-to-Channel Matching (&Delta;Ron): 8.5 Ohm; Voltage - Supply, Single (V+): 2 V ~ 6 V; Switch Time (Ton, Toff) (Max): 51ns, 49ns; -3db Bandwidth: 89MHz; Channel Capacitance (CS(off), CD(off)): 5pF, 50pF; Current - Leakage (IS(off)) (Max): 800nA; Supplier 1: Digi-Key; Manufacturer Part Number: CD74HC4067M96; RoHS: RoHS Compliant; Category: Integrated Circuits (ICs); Stock 1: 5494; Pricing 1: 1=0.77, 10=0.68, 100=0.52, 500=0.412, 1000=0.33 (USD); Packaging: Cut Tape (CT); Switch Circuit: -; Voltage - Supply, Dual (V±): -; Charge Injection: -; Crosstalk: -; Operating Temperature: -55°C ~ 125°C (TA); Package / Case: 24-SOIC (0.295", 7.50mm Width); Supplier Device Package: 24-SOIC; ComponentLink1URL: http://www.ti.com/lit/ds/symlink/cd74hc4067.pdf; ComponentLink1Description: http://www.ti.com/lit/ds/symlink/cd74hc4067.pdf; Supplier Part Number 1: 296-29408-1-ND
USB1 = 61729-1011BLF: USB RCPT B-TYPE R/A FULL BACK; Manufacturer: Amphenol FCI; Connector Type: USB - B; Number of Contacts: 4; Gender: Receptacle; Specifications: USB 2.0; Supplier 1: Digi-Key; Manufacturer Part Number: 61729-1011BLF; RoHS: RoHS Compliant; Category: Connectors, Interconnects; Stock 1: 7879; Pricing 1: 1=0.92, 10=0.806, 50=0.7268, 100=0.6952, 250=0.632, 500=0.5688, 1000=0.5056, 2500=0.4582, 5000=0.4424 (USD); Packaging: Tube; Mounting Type: Through Hole, Right Angle, Horizontal; Features: Board Lock, Shielded; Ingress Protection: -; ComponentLink1URL: http://portal.fciconnect.com/Comergent//fci/drawing/61729.pdf; ComponentLink1Description: http://portal.fciconnect.com/Comergent//fci/drawing/61729.pdf; Supplier Part Number 1: 609-3657-ND
XTAL1 = 9C-16.000MEEJ-T: CRYSTAL 16.0000MHZ 18PF SMD; Manufacturer: TXC CORPORATION; Frequency: 16MHz; Frequency Stability: ±10ppm; ESR (Equivalent Series Resistance): 30 Ohm; Operating Mode: Fundamental; Supplier 1: Digi-Key; Manufacturer Part Number: 9C-16.000MEEJ-T; RoHS: RoHS Compliant; Category: Crystals and Oscillators; Stock 1: 6530; Pricing 1: 1=0.57, 10=0.473, 50=0.4248, 100=0.378, 500=0.36 (USD); Packaging: Cut Tape (CT); Type: MHz Crystal; Frequency Tolerance: ±10ppm; Load Capacitance: 18pF; Operating Temperature: -20°C ~ 70°C; Ratings: -; Mounting Type: Surface Mount; Package / Case: HC49/US; Size / Dimension: 0.449" L x 0.189" W (11.40mm x 4.80mm); Height: 0.161" (4.10mm); ComponentLink1URL: http://www.txccrystal.com/images/pdf/9c-accuracy.pdf; ComponentLink1Description: http://www.txccrystal.com/images/pdf/9c-accuracy.pdf; Supplier Part Number 1: 887-1274-1-ND
Z1 Z2 = CG0603MLC-05E: VARISTOR 0603; Manufacturer: Bourns Inc.; Number of Circuits: 1; Maximum DC Volts: 5VDC; Supplier 1: Digi-Key; Manufacturer Part Number: CG0603MLC-05E; RoHS: RoHS Compliant; Category: Circuit Protection; Stock 1: 177838; Pricing 1: 1=0.19, 10=0.177, 25=0.164, 50=0.158, 100=0.1472, 250=0.13104, 500=0.1092, 1000=0.10348, 2500=0.09256 (USD); Packaging: Cut Tape (CT); Varistor Voltage (Min): -; Varistor Voltage (Typ): -; Varistor Voltage (Max): -; Current - Surge: -; Maximum AC Volts: -; Energy: -; Package / Case: 0603 (1608 Metric); Mounting Type: Surface Mount, MLCV; ComponentLink1URL: http://www.bourns.com/docs/Product-Datasheets/MLC.pdf; ComponentLink1Description: http://www.bourns.com/docs/Product-Datasheets/MLC.pdf; Supplier Part Number 1: CG0603MLC-05ECT-ND